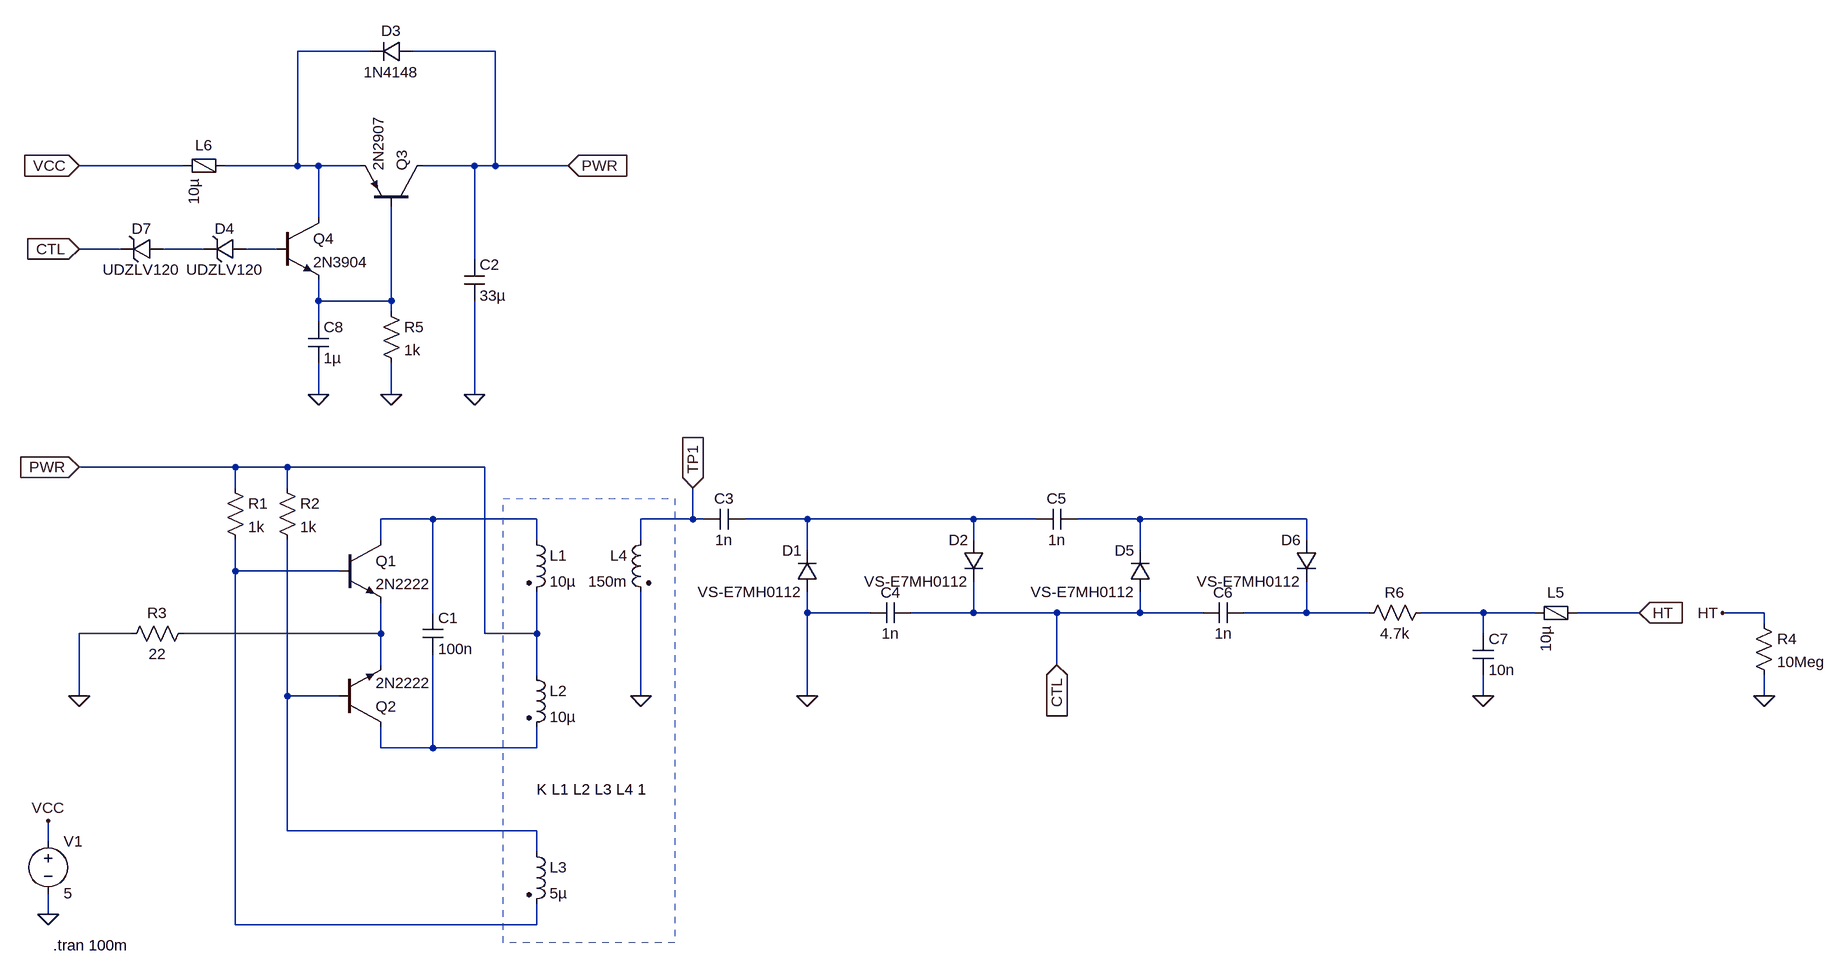
[diagram p0: schematic GM HT OSCILLATOR.asc]
GM HT OSCILLATOR.asc, the LTspice schematic file:
Version 4
SHEET 1 2624 1408
WIRE -672 16 -784 16
WIRE -480 16 -608 16
WIRE -960 192 -1120 192
WIRE -784 192 -784 16
WIRE -784 192 -896 192
WIRE -752 192 -784 192
WIRE -688 192 -752 192
WIRE -512 192 -592 192
WIRE -480 192 -480 16
WIRE -480 192 -512 192
WIRE -368 192 -480 192
WIRE -752 272 -752 192
WIRE -1056 320 -1120 320
WIRE -928 320 -992 320
WIRE -816 320 -864 320
WIRE -512 336 -512 192
WIRE -752 400 -752 368
WIRE -640 400 -640 256
WIRE -640 400 -752 400
WIRE -640 416 -640 400
WIRE -752 432 -752 400
WIRE -752 544 -752 496
WIRE -640 544 -640 496
WIRE -512 544 -512 400
WIRE -880 656 -1120 656
WIRE -800 656 -880 656
WIRE -496 656 -800 656
WIRE -880 688 -880 656
WIRE -800 688 -800 656
WIRE -576 736 -656 736
WIRE -416 736 -576 736
WIRE -176 736 -176 688
WIRE -176 736 -256 736
WIRE -160 736 -176 736
WIRE 0 736 -96 736
WIRE 256 736 0 736
WIRE 352 736 256 736
WIRE 512 736 416 736
WIRE 768 736 512 736
WIRE -656 768 -656 736
WIRE -416 768 -416 736
WIRE -256 768 -256 736
WIRE 256 768 256 736
WIRE 768 768 768 736
WIRE 0 784 0 736
WIRE 512 784 512 736
WIRE -880 816 -880 768
WIRE -720 816 -880 816
WIRE -576 880 -576 736
WIRE 0 880 0 848
WIRE 96 880 0 880
WIRE 256 880 256 832
WIRE 256 880 160 880
WIRE 384 880 256 880
WIRE 512 880 512 848
WIRE 512 880 384 880
WIRE 608 880 512 880
WIRE 768 880 768 832
WIRE 768 880 672 880
WIRE 864 880 768 880
WIRE 1040 880 944 880
WIRE 1120 880 1040 880
WIRE 1280 880 1184 880
WIRE 1472 880 1408 880
WIRE 1472 896 1472 880
WIRE -1040 912 -1120 912
WIRE -656 912 -656 864
WIRE -656 912 -960 912
WIRE -496 912 -496 656
WIRE -416 912 -416 848
WIRE -416 912 -496 912
WIRE 1040 912 1040 880
WIRE -656 960 -656 912
WIRE 384 960 384 880
WIRE -416 976 -416 912
WIRE -1120 1008 -1120 912
WIRE -800 1008 -800 768
WIRE -720 1008 -800 1008
WIRE -256 1008 -256 848
WIRE 0 1008 0 880
WIRE 1040 1008 1040 976
WIRE 1472 1008 1472 976
WIRE -656 1088 -656 1056
WIRE -576 1088 -576 944
WIRE -576 1088 -656 1088
WIRE -416 1088 -416 1056
WIRE -416 1088 -576 1088
WIRE -800 1216 -800 1008
WIRE -416 1216 -800 1216
WIRE -1168 1232 -1168 1200
WIRE -416 1248 -416 1216
WIRE -1168 1344 -1168 1312
WIRE -880 1360 -880 816
WIRE -416 1360 -416 1328
WIRE -416 1360 -880 1360
FLAG -1168 1344 0
FLAG -256 1008 0
FLAG -1168 1200 VCC
FLAG -1120 1008 0
FLAG -1120 192 VCC
IOPIN -1120 192 In
FLAG 0 1008 0
FLAG 1280 880 HT
IOPIN 1280 880 In
FLAG 1472 1008 0
FLAG 1408 880 HT
FLAG 1040 1008 0
FLAG -512 544 0
FLAG -368 192 PWR
IOPIN -368 192 In
FLAG -1120 320 CTL
IOPIN -1120 320 In
FLAG -1120 656 PWR
IOPIN -1120 656 In
FLAG 384 960 CTL
IOPIN 384 960 In
FLAG -176 688 TP1
IOPIN -176 688 In
FLAG -640 544 0
FLAG -752 544 0
SYMBOL npn -720 768 R0
SYMATTR InstName Q1
SYMATTR Value 2N2222
SYMBOL npn -720 1056 M180
SYMATTR InstName Q2
SYMATTR Value 2N2222
SYMBOL ind2 -432 752 R0
SYMATTR InstName L1
SYMATTR Value 10µ
SYMBOL ind2 -432 960 R0
SYMATTR InstName L2
SYMATTR Value 10µ
SYMBOL cap -592 880 R0
SYMATTR InstName C1
SYMATTR Value 100n
SYMBOL res -816 672 R0
SYMATTR InstName R2
SYMATTR Value 1k
SYMBOL res -896 672 R0
SYMATTR InstName R1
SYMATTR Value 1k
SYMBOL res -944 896 R90
WINDOW 0 0 56 VBottom 2
WINDOW 3 32 56 VTop 2
SYMATTR InstName R3
SYMATTR Value 22
SYMBOL ind2 -432 1232 R0
SYMATTR InstName L3
SYMATTR Value 5µ
SYMBOL ind2 -240 752 M0
SYMATTR InstName L4
SYMATTR Value 150m
SYMATTR SpiceLine Rser=250
SYMBOL voltage -1168 1216 R0
SYMATTR InstName V1
SYMATTR Value 5
SYMBOL cap -528 336 R0
SYMATTR InstName C2
SYMATTR Value 33µ
SYMBOL cap -96 720 R90
WINDOW 0 0 32 VBottom 2
WINDOW 3 32 32 VTop 2
SYMATTR InstName C3
SYMATTR Value 1n
SYMBOL diode 16 848 R180
WINDOW 0 24 64 Left 2
WINDOW 3 24 0 Left 2
SYMATTR InstName D1
SYMATTR Value VS-E7MH0112
SYMBOL cap 160 864 R90
WINDOW 0 0 32 VBottom 2
WINDOW 3 32 32 VTop 2
SYMATTR InstName C4
SYMATTR Value 1n
SYMBOL diode 272 768 M0
SYMATTR InstName D2
SYMATTR Value VS-E7MH0112
SYMBOL res 1456 880 R0
SYMATTR InstName R4
SYMATTR Value 10Meg
SYMBOL cap 416 720 R90
WINDOW 0 0 32 VBottom 2
WINDOW 3 32 32 VTop 2
SYMATTR InstName C5
SYMATTR Value 1n
SYMBOL diode 528 848 R180
WINDOW 0 24 64 Left 2
WINDOW 3 24 0 Left 2
SYMATTR InstName D5
SYMATTR Value VS-E7MH0112
SYMBOL cap 672 864 R90
WINDOW 0 0 32 VBottom 2
WINDOW 3 32 32 VTop 2
SYMATTR InstName C6
SYMATTR Value 1n
SYMBOL diode 784 768 M0
SYMATTR InstName D6
SYMATTR Value VS-E7MH0112
SYMBOL res 960 864 R90
WINDOW 0 0 56 VBottom 2
WINDOW 3 32 56 VTop 2
SYMATTR InstName R6
SYMATTR Value 4.7k
SYMBOL cap 1024 912 R0
SYMATTR InstName C7
SYMATTR Value 10n
SYMBOL diode -608 0 R90
WINDOW 0 0 32 VBottom 2
WINDOW 3 32 32 VTop 2
SYMATTR InstName D3
SYMATTR Value 1N4148
SYMBOL FerriteBead 1152 880 R90
WINDOW 0 -16 0 VBottom 2
SYMATTR InstName L5
SYMATTR Value 10µ
SYMBOL FerriteBead -928 192 R90
WINDOW 0 -16 0 VBottom 2
SYMATTR InstName L6
SYMATTR Value 10µ
SYMBOL pnp -592 256 M270
SYMATTR InstName Q3
SYMATTR Value 2N2907
SYMBOL res -656 400 R0
SYMATTR InstName R5
SYMATTR Value 1k
SYMBOL npn -816 272 R0
SYMATTR InstName Q4
SYMATTR Value 2N3904
SYMBOL cap -768 432 R0
SYMATTR InstName C8
SYMATTR Value 1µ
SYMBOL zener -864 304 R90
WINDOW 0 0 32 VBottom 2
WINDOW 3 32 32 VTop 2
SYMATTR InstName D4
SYMATTR Value UDZLV120
SYMATTR Description Diode
SYMATTR Type diode
SYMBOL zener -992 304 R90
WINDOW 0 0 32 VBottom 2
WINDOW 3 32 32 VTop 2
SYMATTR InstName D7
SYMATTR Value UDZLV120
SYMATTR Description Diode
SYMATTR Type diode
TEXT -416 1152 Left 2 !K L1 L2 L3 L4 1
TEXT -1160 1392 Left 2 !.tran 100m
RECTANGLE Normal -468 704 -204 1388 2

The netlist it stands for:
* GM HT OSCILLATOR.asc
Q1 N005 N008 N011 0 2N2222
Q2 N013 N012 N011 0 2N2222
L1 N005 PWR 10µ
L2 PWR N013 10µ
C1 N005 N013 100n
R2 PWR N012 1k
R1 PWR N008 1k
R3 N011 0 22
L3 N012 N008 5µ
L4 TP1 0 150m Rser=250
V1 VCC 0 5
C2 PWR 0 33µ
C3 N006 TP1 1n
D1 0 N006 VS-E7MH0112
C4 CTL 0 1n
D2 N006 CTL VS-E7MH0112
R4 HT 0 10Meg
C5 N007 N006 1n
D5 CTL N007 VS-E7MH0112
C6 N009 CTL 1n
D6 N007 N009 VS-E7MH0112
R6 N010 N009 4.7k
C7 N010 0 10n
D3 PWR N001 1N4148
L5 HT N010 10µ
L6 N001 VCC 10µ
Q3 PWR N004 N001 0 2N2907
R5 N004 0 1k
Q4 N001 N003 N004 0 2N3904
C8 N004 0 1µ
D4 N003 N002 UDZLV120
D7 N002 CTL UDZLV120
.model D D
.lib standard.dio
.model NPN NPN
.model PNP PNP
.lib standard.bjt
K L1 L2 L3 L4 1
.tran 100m
.backanno
.end